# Altium schematic sheet PAGE0.SchDoc
size B; ApprovedBy: Touraj; DrawnBy: Juan A. Nadal; Engineer: Touraj; Organization: ActiveWave; Address1: 902 Clint Moore Rd., Suite 118; Address2: Boca Raton; Address3: FL, 33487; Address4: 561-999-9422; PageSetup: Record=PageOptions|CenterHorizontal=True|CenterVertical=True|PrintScale=1.05|XCorrection=1.00|YCorrection=1.00|PrintKind=0|BorderSize=5000000|LeftOffset=0|BottomOffset=0|Orientation=2|PaperLength=1000|PaperWidth=1000|Scale=100|PaperSource=7|PrintQuality=-4|MediaType=1|DitherType=10|PaperKind=Letter|PrintScaleMode=1; Project: XXXXXXXXXXXXXXXXXXXXXXXXXX
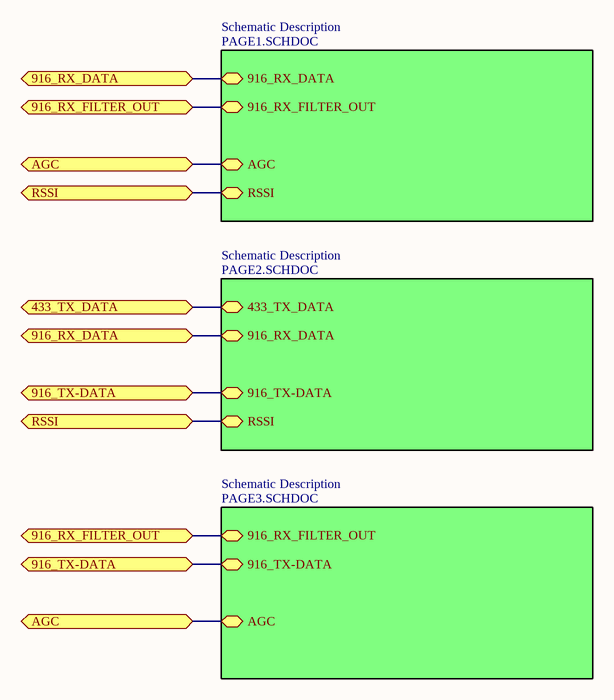
[diagram p0: PAGE0.SchDoc]

## Sub-sheets
Schematic Description = PAGE3.SCHDOC: 916_RX_FILTER_OUT, 916_TX-DATA, AGC
Schematic Description = PAGE2.SCHDOC: 433_TX_DATA, 916_RX_DATA, 916_TX-DATA, RSSI
Schematic Description = PAGE1.SCHDOC: 916_RX_DATA, 916_RX_FILTER_OUT, AGC, RSSI

## Ports
433_TX_DATA, 916_RX_DATA, 916_RX_FILTER_OUT, 916_TX-DATA, AGC, RSSI

## Nets
433_TX_DATA: port 433_TX_DATA, sheet Schematic Description/433_TX_DATA
916_RX_DATA: port 916_RX_DATA, sheet Schematic Description/916_RX_DATA, sheet Schematic Description/916_RX_DATA
916_RX_FILTER_OUT: port 916_RX_FILTER_OUT, sheet Schematic Description/916_RX_FILTER_OUT, sheet Schematic Description/916_RX_FILTER_OUT
916_TX-DATA: port 916_TX-DATA, sheet Schematic Description/916_TX-DATA, sheet Schematic Description/916_TX-DATA
AGC: port AGC, sheet Schematic Description/AGC, sheet Schematic Description/AGC
RSSI: port RSSI, sheet Schematic Description/RSSI, sheet Schematic Description/RSSI

## Notes on the sheet
- APPROVALS
- DATE
- Title:
- Drawn:
- Checked:
- Release:
- Date:
- Size:
- Sheet Name:
- B
- Number:
- Time:
- Revision:
- Sheet
- of
- File: